# EAGLE design motor_driver (EAGLE 9.6.1)
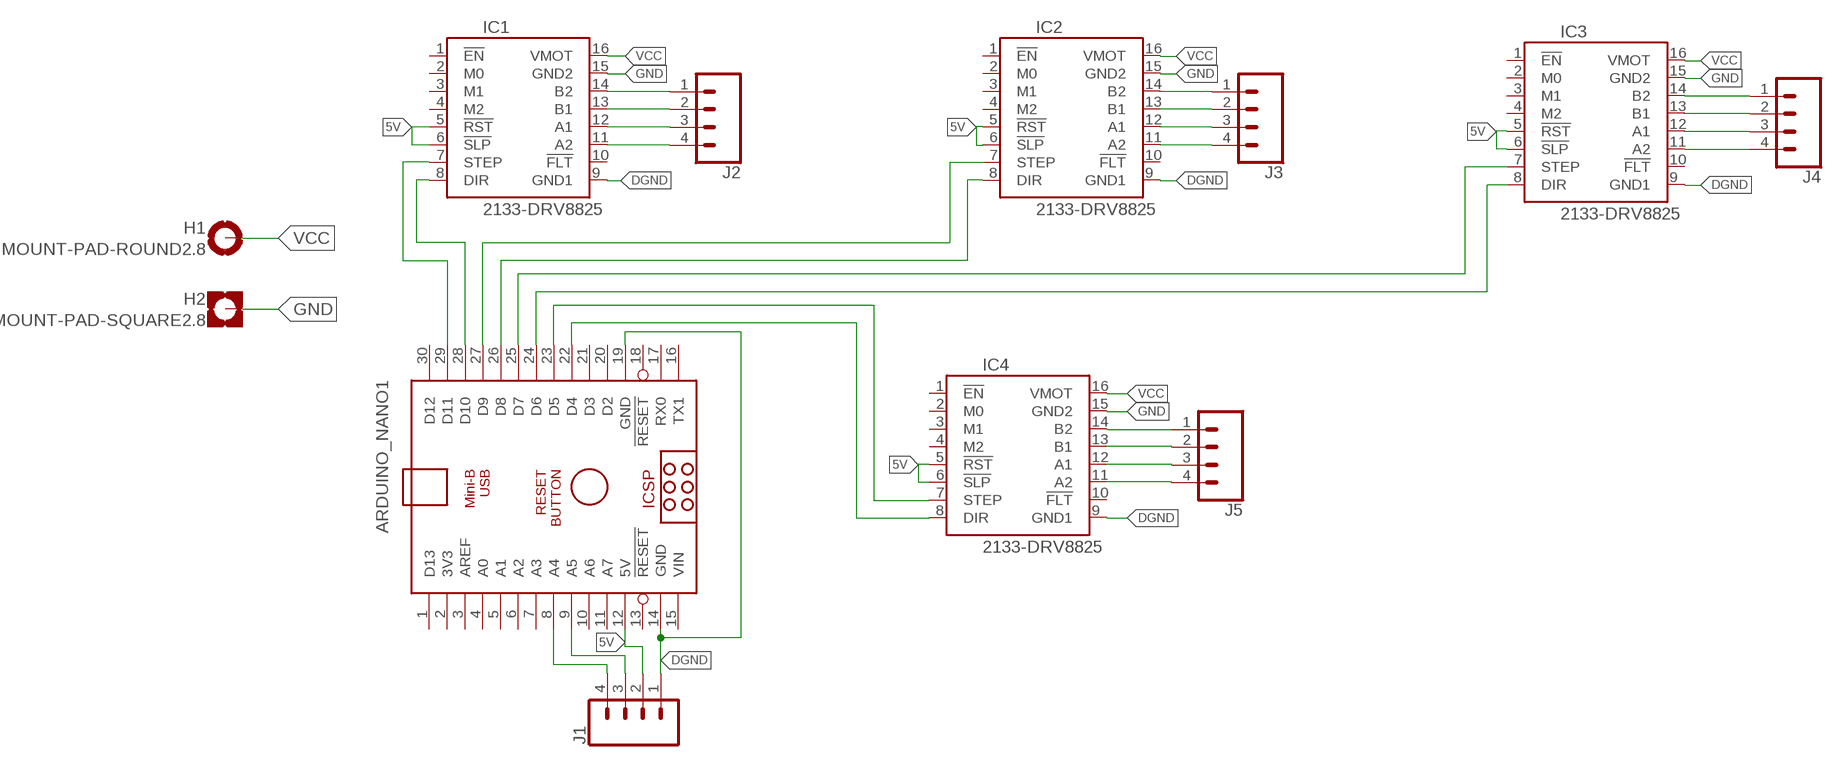
[diagram p0: schematic, sheet 1]

## Parts
ARDUINO_NANO1  ARDUINO_NANO  [ARDUINO_NANO]
H1  MOUNT-PAD-ROUND2.8  [2,8-PAD]
H2  MOUNT-PAD-SQUARE2.8  [2,8-PAD-SQUARE]
IC1  2133-DRV8825  [DRV8825]
IC2  2133-DRV8825  [DRV8825]
IC3  2133-DRV8825  [DRV8825]
IC4  2133-DRV8825  [DRV8825]
J1  CONN_04  [1X04]
J2  CONN_04  [1X04]
J3  CONN_04  [1X04]
J4  CONN_04  [1X04]
J5  CONN_04  [1X04]

## Nets
5V: ARDUINO_NANO1.12(5V) IC1.5(!RST) IC1.6(!SLP) IC2.5(!RST) IC2.6(!SLP) IC3.5(!RST) IC3.6(!SLP) IC4.5(!RST) IC4.6(!SLP) J1.2
DGND: ARDUINO_NANO1.14(GND) ARDUINO_NANO1.19(GND) IC1.9(GND1) IC2.9(GND1) IC3.9(GND1) IC4.9(GND1) J1.1
GND: H2.B2,8(MOUNT) IC1.15(GND2) IC2.15(GND2) IC3.15(GND2) IC4.15(GND2)
N$1: ARDUINO_NANO1.29(D11) IC1.7(STEP)
N$3: ARDUINO_NANO1.9(A5) J1.3
N$4: ARDUINO_NANO1.8(A4) J1.4
N$5: ARDUINO_NANO1.25(D7) IC3.7(STEP)
N$7: ARDUINO_NANO1.26(D8) IC2.8(DIR)
N$8: ARDUINO_NANO1.28(D10) IC1.8(DIR)
N$9: ARDUINO_NANO1.23(D5) IC4.7(STEP)
N$10: IC1.14(B2) J2.1
N$11: ARDUINO_NANO1.24(D6) IC3.8(DIR)
N$12: IC1.13(B1) J2.2
N$13: IC1.12(A1) J2.3
N$14: ARDUINO_NANO1.27(D9) IC2.7(STEP)
N$15: IC1.11(A2) J2.4
N$16: IC2.14(B2) J3.1
N$17: IC2.13(B1) J3.2
N$18: IC2.12(A1) J3.3
N$19: IC2.11(A2) J3.4
N$20: IC3.14(B2) J4.1
N$21: IC3.13(B1) J4.2
N$22: IC3.12(A1) J4.3
N$23: IC3.11(A2) J4.4
N$24: IC4.14(B2) J5.1
N$25: IC4.13(B1) J5.2
N$26: IC4.12(A1) J5.3
N$27: IC4.11(A2) J5.4
N$29: ARDUINO_NANO1.22(D4) IC4.8(DIR)
VCC: H1.B2,8(MOUNT) IC1.16(VMOT) IC2.16(VMOT) IC3.16(VMOT) IC4.16(VMOT)
Unconnected: ARDUINO_NANO1.1(D13) ARDUINO_NANO1.2(3V3) ARDUINO_NANO1.3(AREF) ARDUINO_NANO1.4(A0) ARDUINO_NANO1.5(A1) ARDUINO_NANO1.6(A2) ARDUINO_NANO1.7(A3) ARDUINO_NANO1.10(A6) ARDUINO_NANO1.11(A7) ARDUINO_NANO1.13(!RESET) ARDUINO_NANO1.16(TX1) ARDUINO_NANO1.17(RX0) ARDUINO_NANO1.18(!RESET) ARDUINO_NANO1.20(D2) ARDUINO_NANO1.21(D3) ARDUINO_NANO1.30(D12) IC1.1(!EN) IC1.2(M0) IC1.3(M1) IC1.4(M2) IC1.10(!FLT) IC2.1(!EN) IC2.2(M0) IC2.3(M1) IC2.4(M2) IC2.10(!FLT) IC3.1(!EN) IC3.2(M0) IC3.3(M1) IC3.4(M2) IC3.10(!FLT) IC4.1(!EN) IC4.2(M0) IC4.3(M1) IC4.4(M2) IC4.10(!FLT)

## Power pins joined to a net without a drawn wire
VIN: ARDUINO_NANO1.15(VIN)

## Library data of the parts
ARDUINO_NANO1 = ArduinoNanoV30:ARDUINO_NANO: Arduino Nano V3.0 Overview: The Arduino Nano is a small, complete, and breadboard-friendly board based on the ATmega328 (Arduino Nano 3.x) or ATmega168 (Arduino Nano 2.x). It has more or less the same functionality of the Arduino Duemilanove, but in a different package. It lacks only a DC power jack, and works with a Mini-B USB cable instead of a standard one. The Nano was designed and is being produced by Gravitech. Specifications: Microcontroller Atmel ATmega168 or ATmega328 Operating Voltage (logic level) 5 V Input Voltage (recommended) 7-12 V Input Voltage (limits) 6-20 V Digital I/O Pins 14 (of which 6 provide PWM output) Analog Input Pins 8 DC Current per I/O Pin 40 mA Flash Memory 16 KB (ATmega168) or 32 KB (ATmega328) of which 2 KB used by bootloader SRAM 1 KB (ATmega168) or 2 KB (ATmega328) EEPROM 512 bytes (ATmega168) or 1 KB (ATmega328) Clock Speed 16 MHz Dimensions 0.73" x 1.70" Length 45 mm Width 18 mm Weigth 5 g Power: The Arduino Nano can be powered via the Mini-B USB connection, 6-20V unregulated external power supply (pin 30), or 5V regulated external power supply (pin 27). The power source is automatically selected to the highest voltage source. Memory: The ATmega168 has 16 KB of flash memory for storing code (of which 2 KB is used for the bootloader); the ATmega328 has 32 KB, (also with 2 KB used for the bootloader). The ATmega168 has 1 KB of SRAM and 512 bytes of EEPROM (which can be read and written with the EEPROM library); the ATmega328 has 2 KB of SRAM and 1 KB of EEPROM. Input and Output: Each of the 14 digital pins on the Nano can be used as an input or output, using pinMode(), digitalWrite(), and digitalRead() functions. They operate at 5 volts. Each pin can provide or receive a maximum of 40 mA and has an internal pull-up resistor (disconnected by default) of 20-50 kOhms. In addition, some pins have specialized functions. Visit Arduino - ArduinoBoardNano <https://www.arduino.cc/en/Main/ArduinoBoardNano>
H1 = holes:MOUNT-PAD-ROUND: MOUNTING PAD, round
H2 = holes:MOUNT-PAD-SQUARE: MOUNTING PAD, square
IC1-IC4 = pololu-stepper-driver:2133-DRV8825: DRV8825 Stepper Motor Driver Carrier, High Current #2133 DRV8825 Stepper Motor Driver Carrier; High Current <https://www.pololu.com/product/2133> in Japan, Suzaku Lab. Ltd. <https://suzakugiken.jp/> #2133 DRV8825 大電流用ステッピングモータドライバ <https://szc.jp/po2133>
J1-J5 = SparkFun-Connectors:CONN_04: Multi connection point. Often used as Generic Header-pin footprint for 0.1 inch spaced/style header connections On any of the 0.1 inch spaced packages, you can populate with these: Break Away Headers - Straight <https://www.sparkfun.com/products/116> (PRT-00116) Break Away Male Headers - Right Angle <https://www.sparkfun.com/products/553> (PRT-00553) Female Headers <https://www.sparkfun.com/products/115> (PRT-00115) Break Away Headers - Machine Pin <https://www.sparkfun.com/products/117> (PRT-00117) Break Away Female Headers - Swiss Machine Pin <https://www.sparkfun.com/products/743> (PRT-00743) For SCREWTERMINALS and SPRING TERMINALS visit here: Screw Terimnals on SparkFun.com <https://www.sparkfun.com/search/results?term=Screw+Terminals> (5mm/3.5mm/2.54mm spacing) This device is also useful as a general connection point to wire up your design to another part of your project. Our various solder wires solder well into these plated through hole pads. Hook-Up Wire - Assortment (Stranded, 22 AWG) <https://www.sparkfun.com/products/11375> (PRT-11375) Hook-Up Wire - Assortment (Solid Core, 22 AWG) <https://www.sparkfun.com/products/11367> (PRT-11367) View the entire wire category on our website here <https://www.sparkfun.com/categories/141> Special notes: Molex polarized connector foot print use with SKU : PRT-08231 with associated crimp pins and housings. 1MM SMD Version SKU: PRT-10208; PROD_ID: CONN-09696

## Board
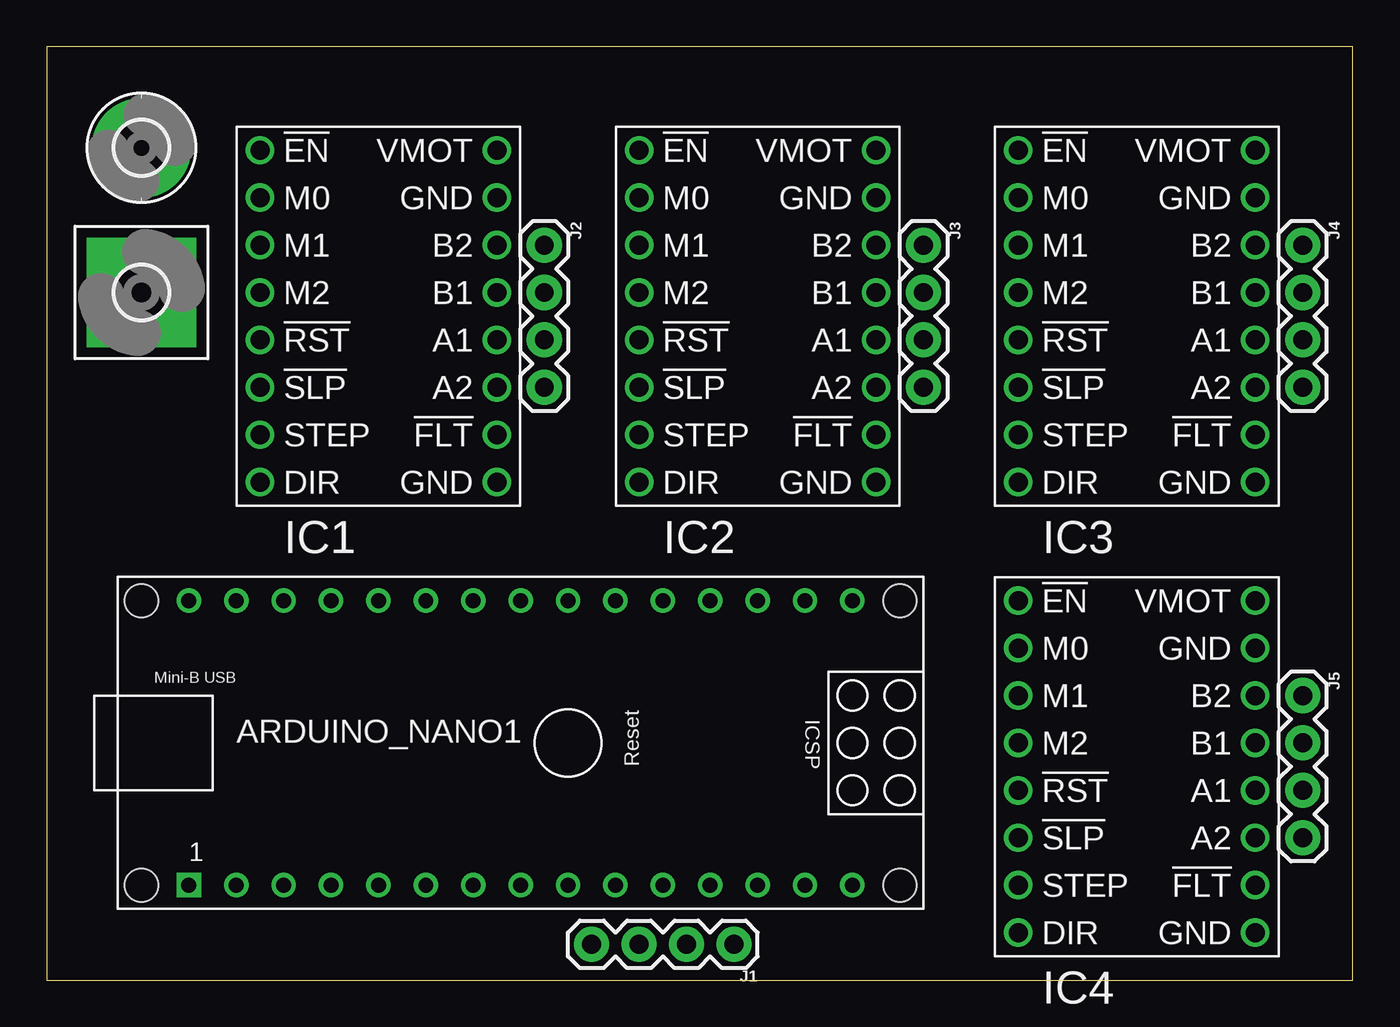
[diagram p1: board, top side]
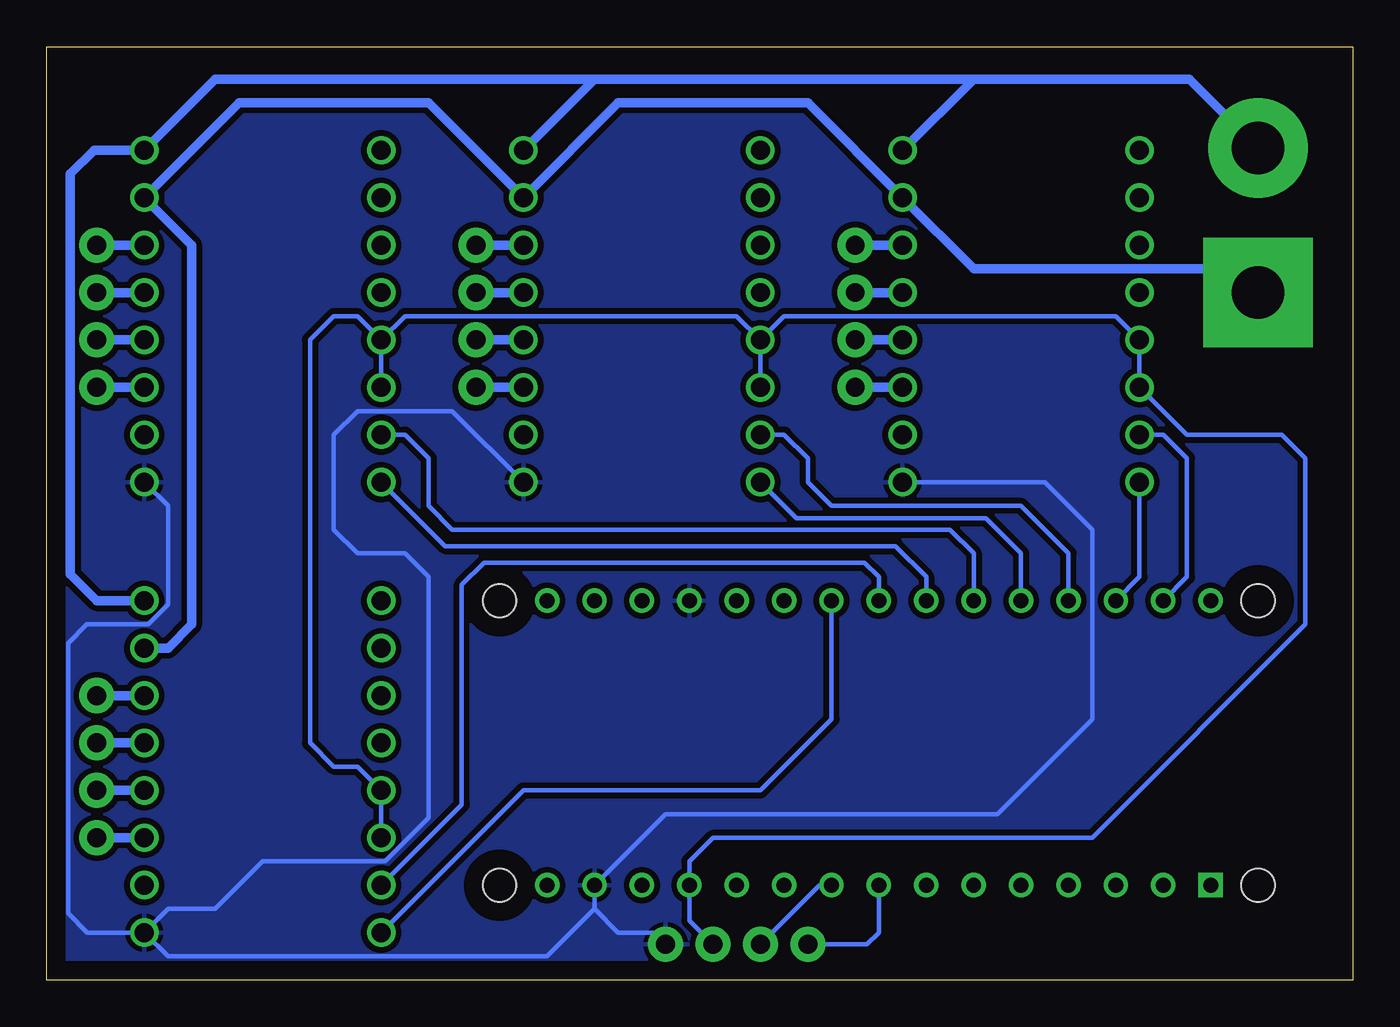
[diagram p2: board, bottom side, seen from below]

Size 70 x 50 mm. Coordinates in mm from the lower left corner, seen from the top.
Outline: 0,0 70,0 70,50 0,50 0,0
Copper layers (1*16): Top 0.035mm / dielectric 1.5mm / Bottom 0.035mm
Design rules "default": minimum track width 6mil, minimum drill 0.35mm, track to track 6mil, track to pad 6mil, pad to pad 6mil, via to via 6mil, smd to smd 6mil, copper to edge 40mil, drill to drill 6mil, minimum pad ring 10mil, minimum via ring 8mil, stop-mask expansion 4mil, vias tented up to drill 0mil, thermal gap 10mil

### Footprints (pad centres in the part's own frame; a part is rotated, then mirrored left to right if it is on the bottom)
ARDUINO_NANO = drill 0.8 square: 1 -20.32,-7.62 | drill 0.8: 2 -17.78,-7.62; 3 -15.24,-7.62; 4 -12.7,-7.62; 5 -10.16,-7.62; 6 -7.62,-7.62; 7 -5.08,-7.62; 8 -2.54,-7.62; 9 0,-7.62; 10 2.54,-7.62; 11 5.08,-7.62; 12 7.62,-7.62; 13 10.16,-7.62; 14 12.7,-7.62; 15 15.24,-7.62; 16 15.24,7.62; 17 12.7,7.62; 18 10.16,7.62; 19 7.62,7.62; 20 5.08,7.62; 21 2.54,7.62; 22 0,7.62; 23 -2.54,7.62; 24 -5.08,7.62; 25 -7.62,7.62; 26 -10.16,7.62; 27 -12.7,7.62; 28 -15.24,7.62; 29 -17.78,7.62; 30 -20.32,7.62 | hole 1.778: -22.86,-7.62; -22.86,7.62; 17.78,7.62; 17.78,-7.62
2,8-PAD = drill 2.8 pad 5.334: B2,8 0,0
2,8-PAD-SQUARE = drill 2.8 pad 5.842 square: B2,8 0,0
DRV8825 = drill 1.016: 1 -6.35,8.89; 2 -6.35,6.35; 3 -6.35,3.81; 4 -6.35,1.27; 5 -6.35,-1.27; 6 -6.35,-3.81; 7 -6.35,-6.35; 8 -6.35,-8.89; 9 6.35,-8.89; 10 6.35,-6.35; 11 6.35,-3.81; 12 6.35,-1.27; 13 6.35,1.27; 14 6.35,3.81; 15 6.35,6.35; 16 6.35,8.89
1X04 = drill 1.016 pad 1.88: 1 0,0; 2 2.54,0; 3 5.08,0; 4 7.62,0

### Placement (x,y rotation side)
ARDUINO_NANO1  27.94,12.7 0 top
H1  5.08,44.58 0 top
H2  5.08,36.83 0 top
IC1  17.78,35.56 0 top
IC2  38.1,35.56 0 top
IC3  58.42,35.56 0 top
IC4  58.42,11.43 0 top
J1  36.83,1.91 180 top
J2  26.67,39.37 270 top
J3  46.99,39.37 270 top
J4  67.31,39.37 270 top
J5  67.31,15.24 270 top

### Tracks (layer width: path | path; a pad name or v marks a point on that pad's centre or on a via)
5V
  Bottom 0.254: IC2.5 IC2.6 | IC3.5 IC3.6 | IC4.6 IC4.5 53.34,11.43 54.61,11.43 55.88,12.7 55.88,34.29 54.61,35.56 53.34,35.56 IC3.5 | IC2.5 33.02,35.56 50.8,35.56 IC3.5 | IC2.5 30.48,35.56 12.7,35.56 IC1.5 IC1.6 8.89,29.21 3.81,29.21 2.54,27.94 2.54,19.05 13.97,7.62 34.29,7.62 35.56,6.35 ARDUINO_NANO1.12 35.56,3.17 J1.2
DGND
  Bottom 0.254: J1.1 37.47,2.54 39.37,2.54 40.64,3.81 | 40.64,3.81 ARDUINO_NANO1.14 36.83,8.89 19.05,8.89 13.97,13.97 13.97,24.13 16.51,26.67 IC1.9 | IC3.9 63.5,25.4 63.5,20.12 64.57,19.05 67.84,19.05 68.86,18.03 68.86,3.58 67.82,2.54 IC4.9 | IC4.9 63.5,1.27 43.18,1.27 40.64,3.81 | IC4.9 63.5,3.81 60.96,3.81 58.42,6.35 51.87,6.35 49.53,8.69 49.53,21.59 50.8,22.86 53.34,22.86 54.61,24.13 54.61,29.21 53.34,30.48 48.26,30.48 IC2.9
  pour Bottom (isolate 0.305): -1.27,52.07 -1.27,-1.27 71.12,-1.27 71.12,52.07
GND
  Bottom 0.508: IC4.15 63.5,17.78 62.23,19.05 62.23,39.37 IC3.15 59.69,46.99 49.53,46.99 IC2.15 39.37,46.99 29.21,46.99 IC1.15 20.32,38.1 6.35,38.1 H2.B2,8
N$1
  Bottom 0.254: ARDUINO_NANO1.29 8.89,21.59 8.89,27.94 10.16,29.21 IC1.7
N$3
  Bottom 0.254: ARDUINO_NANO1.9 28.57,5.08 J1.3
N$4
  Bottom 0.254: J1.4 26.04,1.91 25.4,2.54 ARDUINO_NANO1.8
N$5
  Bottom 0.254: IC3.7 50.8,29.21 49.53,27.94 49.53,25.4 48.26,24.13 21.59,24.13 20.32,22.86 ARDUINO_NANO1.25
N$7
  Bottom 0.254: IC2.8 29.82,24.74 19.66,24.74 17.78,22.86 ARDUINO_NANO1.26
N$8
  Bottom 0.254: ARDUINO_NANO1.28 11.43,21.59 IC1.8
N$9
  Bottom 0.254: ARDUINO_NANO1.23 25.4,21.59 26.16,22.35 46.56,22.35 47.75,21.16 47.75,9.4 IC4.7
N$10
  Bottom 0.508: IC1.14 J2.1
N$11
  Bottom 0.254: IC3.8 48.64,23.24 24.51,23.24 22.86,21.59 ARDUINO_NANO1.24
N$12
  Bottom 0.508: IC1.13 J2.2
N$13
  Bottom 0.508: IC1.12 J2.3
N$14
  Bottom 0.254: ARDUINO_NANO1.27 15.24,22.86 17.78,25.4 27.94,25.4 29.21,26.67 29.21,27.94 30.48,29.21 IC2.7
N$15
  Bottom 0.508: IC1.11 J2.4
N$16
  Bottom 0.508: IC2.14 J3.1
N$17
  Bottom 0.508: IC2.13 J3.2
N$18
  Bottom 0.508: J3.3 IC2.12
N$19
  Bottom 0.508: IC2.11 J3.4
N$20
  Bottom 0.508: IC3.14 J4.1
N$21
  Bottom 0.508: IC3.13 J4.2
N$22
  Bottom 0.508: IC3.12 J4.3
N$23
  Bottom 0.508: J4.4 IC3.11
N$24
  Bottom 0.508: IC4.14 J5.1
N$25
  Bottom 0.508: IC4.13 J5.2
N$26
  Bottom 0.508: J5.3 IC4.12
N$27
  Bottom 0.508: IC4.11 J5.4
N$29
  Bottom 0.254: IC4.8 44.45,10.16 31.75,10.16 27.94,13.97 ARDUINO_NANO1.22
VCC
  Bottom 0.508: H1.B2,8 8.76,48.26 20.32,48.26 | 20.32,48.26 IC1.16 | 20.32,48.26 40.64,48.26 | IC2.16 40.64,48.26 | 40.64,48.26 60.96,48.26 IC3.16 67.46,44.45 68.73,43.18 68.73,21.74 67.31,20.32 IC4.16